# EAGLE design stm32-tf (EAGLE 6.6.0)
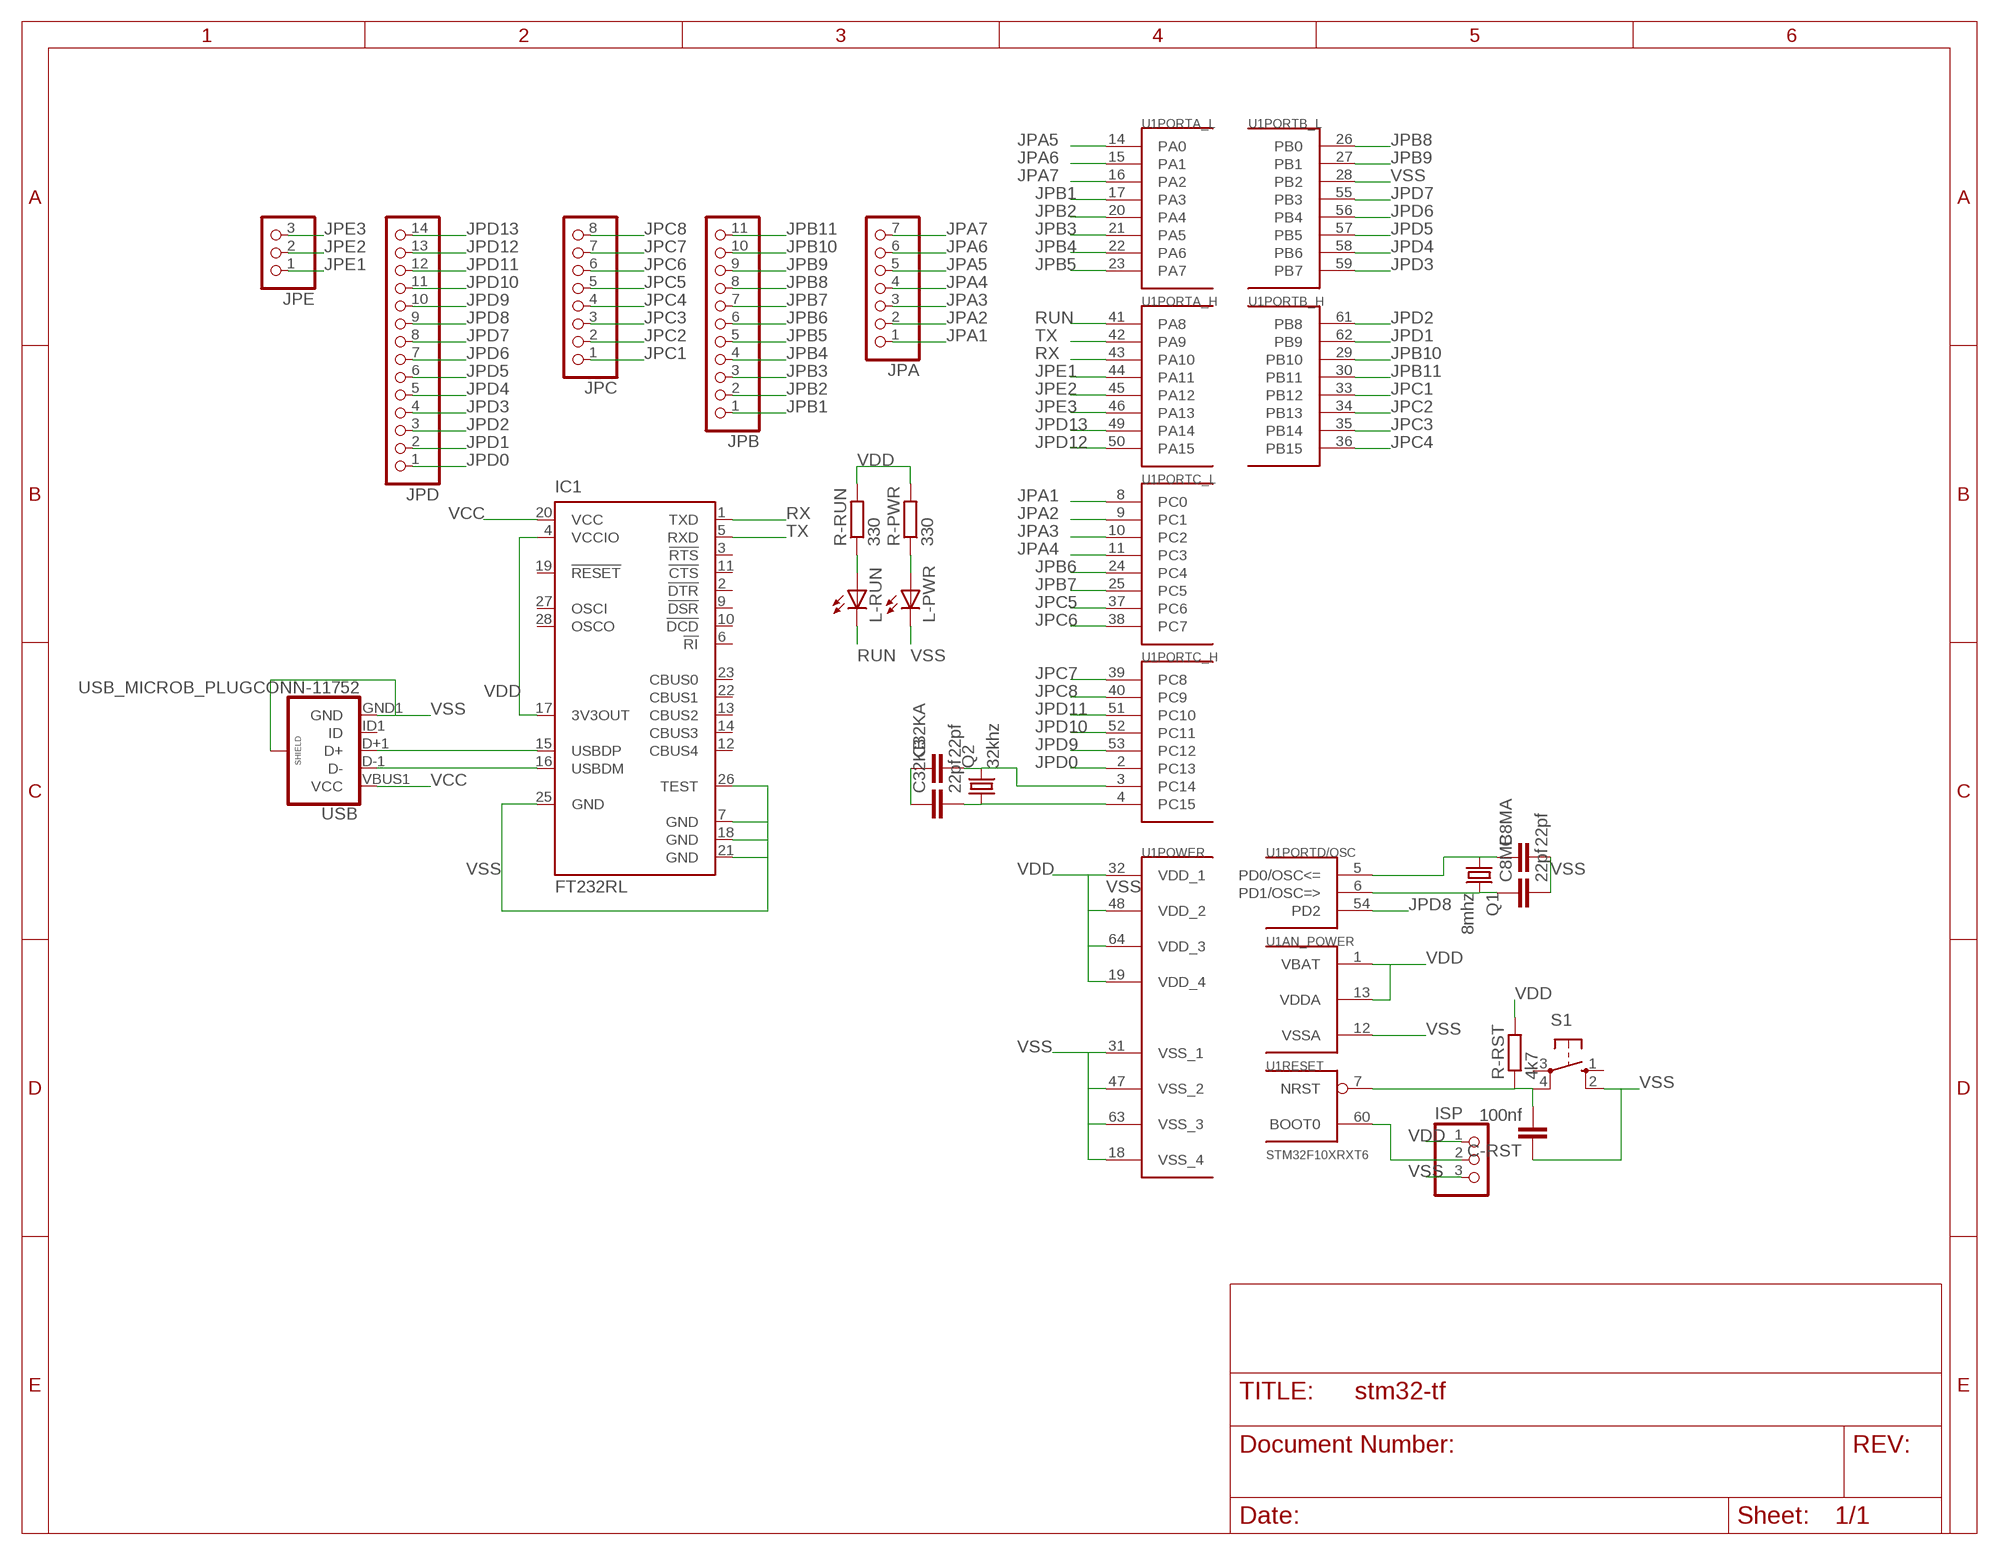
[diagram p0: schematic, sheet 1, part 1 of 2]
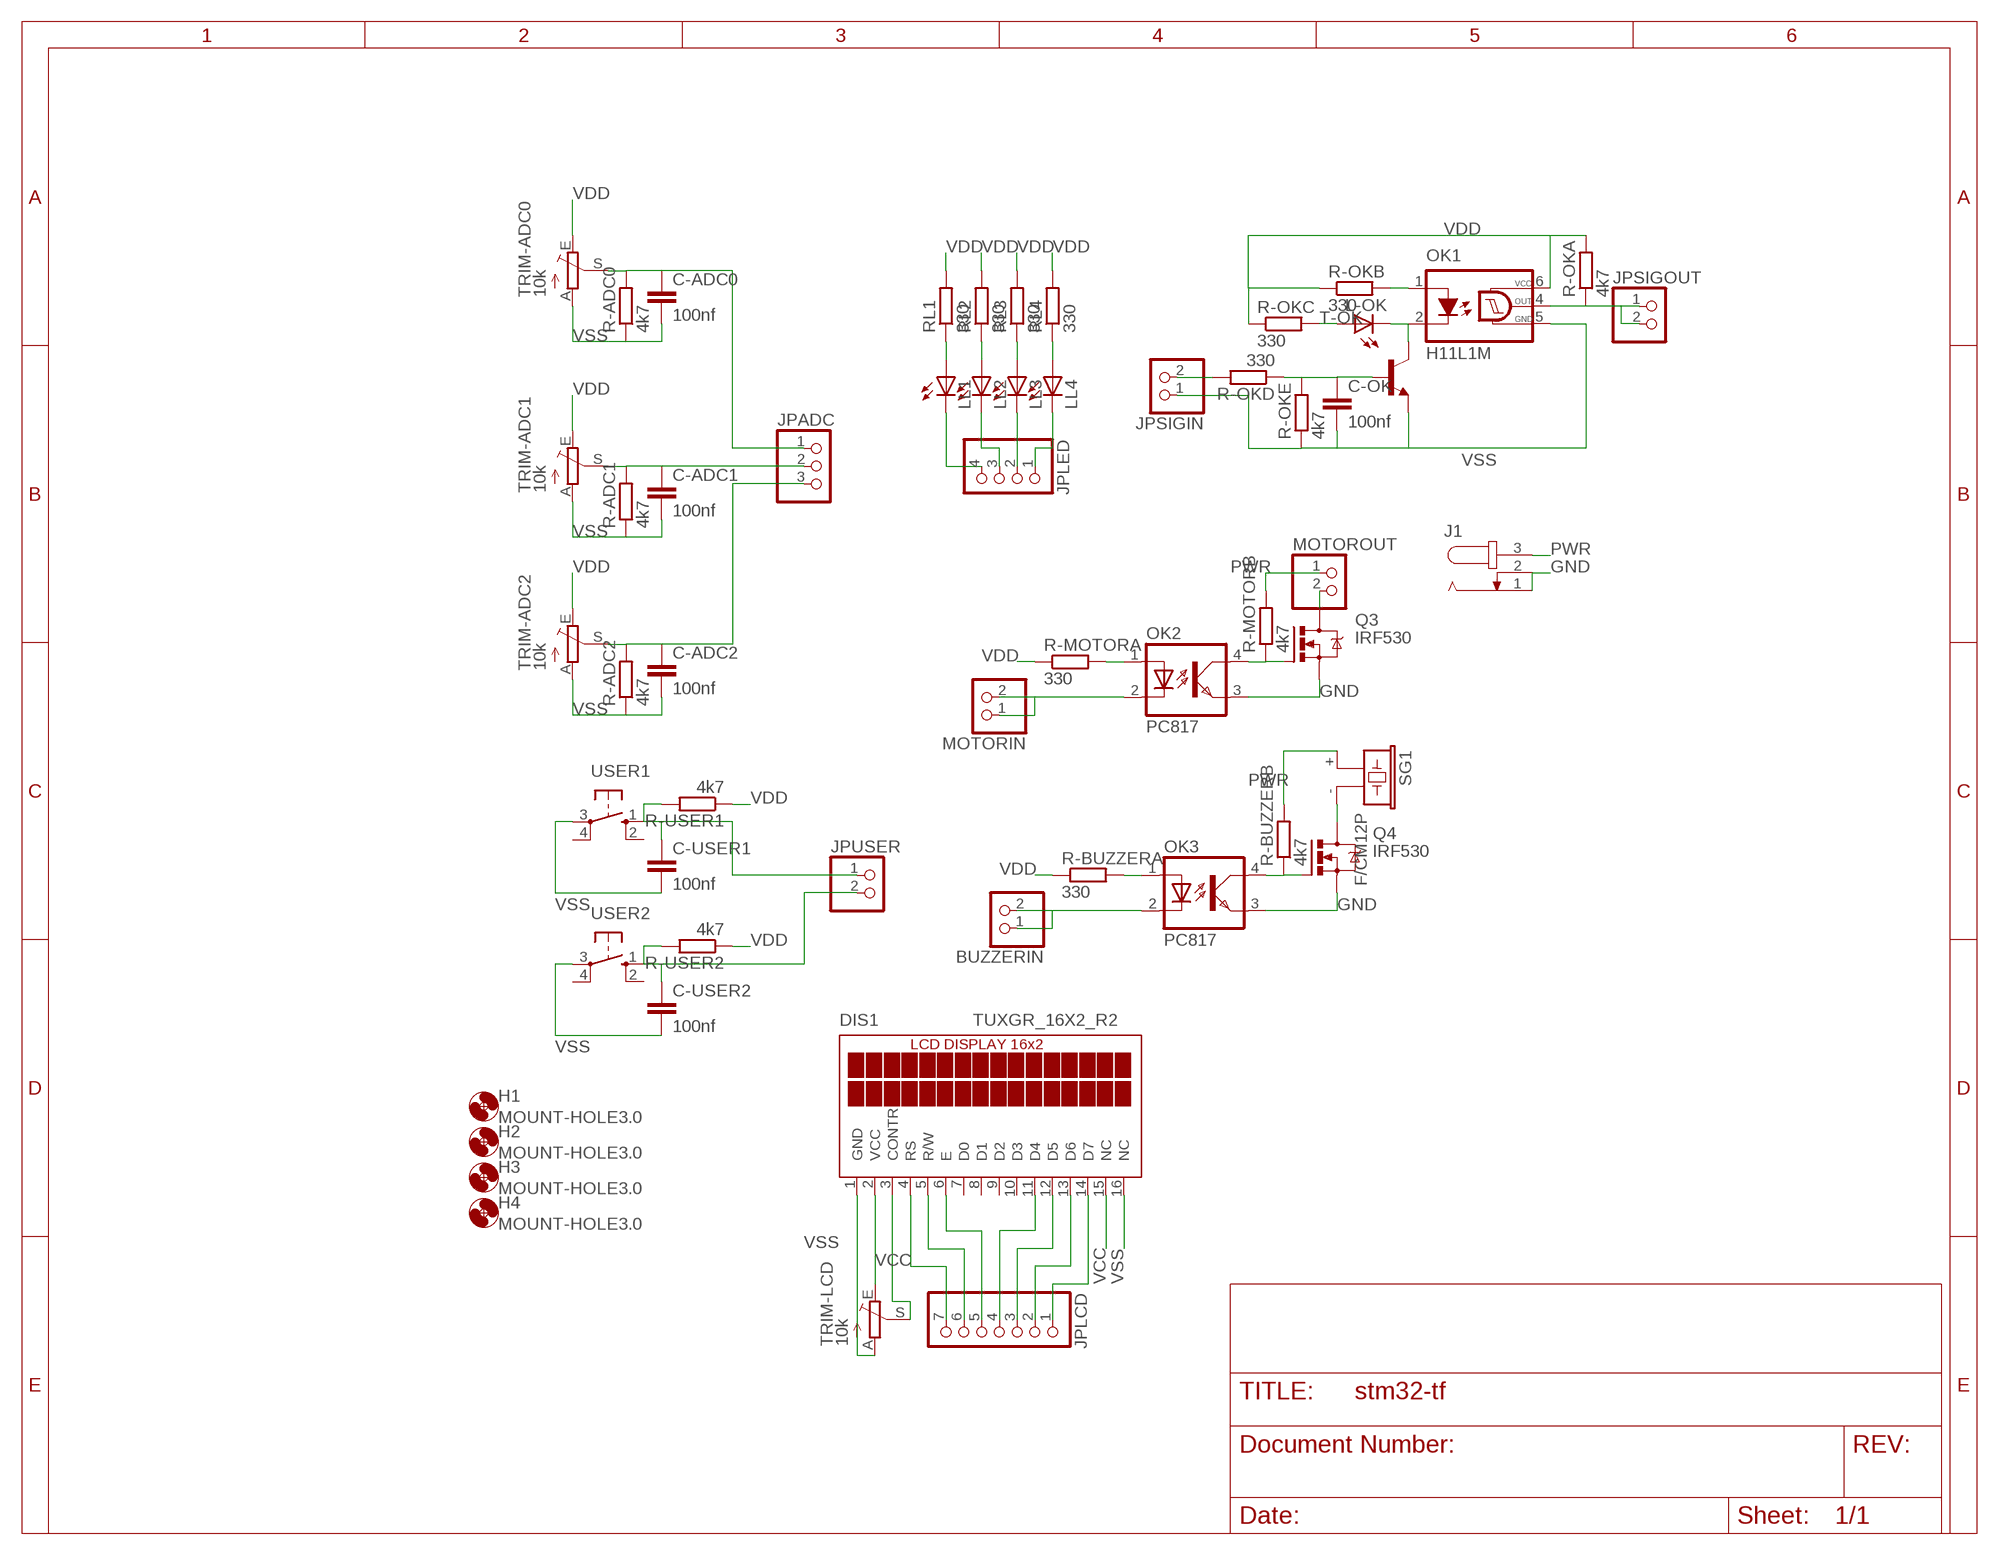
[diagram p1: schematic, sheet 1, part 2 of 2]

## Parts
BUZZERIN  PINHD-1X2  [1X02]
C8MA  22pf  C-EUC1206  [C1206]
C8MB  22pf  C-EUC1206  [C1206]
C32KA  22pf  C-EUC1206  [C1206]
C32KB  22pf  C-EUC1206  [C1206]
C-ADC0  100nf  C-EUC1206  [C1206]
C-ADC1  100nf  C-EUC1206  [C1206]
C-ADC2  100nf  C-EUC1206  [C1206]
C-OK  100nf  C-EUC1206  [C1206]
C-RST  100nf  C-EUC1206  [C1206]
C-USER1  100nf  C-EUC1206  [C1206]
C-USER2  100nf  C-EUC1206  [C1206]
DIS1  TUXGR_16X2_R2  [TUXGR_16X2_R2]
H1  MOUNT-HOLE3.0  [3,0]
H2  MOUNT-HOLE3.0  [3,0]
H3  MOUNT-HOLE3.0  [3,0]
H4  MOUNT-HOLE3.0  [3,0]
IC1  FT232RL  [SSOP28]
ISP  PINHD-1X3  [1X03]
J1  JACK-PLUG0  [SPC4077]
JPA  PINHD-1X7  [1X07]
JPADC  PINHD-1X3  [1X03]
JPB  PINHD-1X11  [1X11]
JPC  PINHD-1X8  [1X08]
JPD  PINHD-1X14  [1X14]
JPE  PINHD-1X3  [1X03]
JPLCD  PINHD-1X7  [1X07]
JPLED  PINHD-1X4  [1X04]
JPSIGIN  PINHD-1X2  [1X02]
JPSIGOUT  PINHD-1X2  [1X02]
JPUSER  PINHD-1X2  [1X02]
L-OK  LEDSML1206  [SML1206]
L-PWR  LEDSML1206  [SML1206]
L-RUN  LEDSML1206  [SML1206]
LL1  LEDSML1206  [SML1206]
LL2  LEDSML1206  [SML1206]
LL3  LEDSML1206  [SML1206]
LL4  LEDSML1206  [SML1206]
MOTORIN  PINHD-1X2  [1X02]
MOTOROUT  PINHD-1X2  [1X02]
OK1  H11L1M  [DIL06]
OK2  PC817  [DIL04]
OK3  PC817  [DIL04]
Q1  8mhz  CRYSTALHC49U-V  [HC49U-V]
Q2  32khz  CRYSTALTC38H  [TC38H]
Q3  IRF530  [TO220BV]
Q4  IRF530  [TO220BV]
R-ADC0  4k7  R-EU_R1206  [R1206]
R-ADC1  4k7  R-EU_R1206  [R1206]
R-ADC2  4k7  R-EU_R1206  [R1206]
R-BUZZERA  330  R-EU_R1206  [R1206]
R-BUZZERB  4k7  R-EU_R1206  [R1206]
R-MOTORA  330  R-EU_R1206  [R1206]
R-MOTORB  4k7  R-EU_R1206  [R1206]
R-OKA  4k7  R-EU_R1206  [R1206]
R-OKB  330  R-EU_R1206  [R1206]
R-OKC  330  R-EU_R1206  [R1206]
R-OKD  330  R-EU_R1206  [R1206]
R-OKE  4k7  R-EU_R1206  [R1206]
R-PWR  330  R-EU_R1206  [R1206]
R-RST  4k7  R-EU_R1206  [R1206]
R-RUN  330  R-EU_R1206  [R1206]
R-USER1  4k7  R-EU_R1206  [R1206]
R-USER2  4k7  R-EU_R1206  [R1206]
RL1  330  R-EU_R1206  [R1206]
RL2  330  R-EU_R1206  [R1206]
RL3  330  R-EU_R1206  [R1206]
RL4  330  R-EU_R1206  [R1206]
S1  10-XX  [B3F-10XX]
SG1  F/CM12P  [F/CM12P]
T-OK  2N3904-NPN-TO92-EBC  [TO92-EBC]
TRIM-ADC0  10k  TRIM_EU-CA6V  [CA6V]
TRIM-ADC1  10k  TRIM_EU-CA6V  [CA6V]
TRIM-ADC2  10k  TRIM_EU-CA6V  [CA6V]
TRIM-LCD  10k  TRIM_EU-CA6V  [CA6V]
U1  STM32F10XRXT6  [TQFP64]
USB  USB_MICROB_PLUGCONN-11752  [USB-B-MICRO-SMD_V03]
USER1  10-XX  [B3F-10XX]
USER2  10-XX  [B3F-10XX]

## Nets
GND: J1.1 J1.2 OK2.3(EMIT) OK3.3(EMIT) Q3.S Q4.S
JPA1: JPA.1 U1.8(PORTC_L:PC0)
JPA2: JPA.2 U1.9(PORTC_L:PC1)
JPA3: JPA.3 U1.10(PORTC_L:PC2)
JPA4: JPA.4 U1.11(PORTC_L:PC3)
JPA5: JPA.5 U1.14(PORTA_L:PA0)
JPA6: JPA.6 U1.15(PORTA_L:PA1)
JPA7: JPA.7 U1.16(PORTA_L:PA2)
JPB1: JPB.1 U1.17(PORTA_L:PA3)
JPB2: JPB.2 U1.20(PORTA_L:PA4)
JPB3: JPB.3 U1.21(PORTA_L:PA5)
JPB4: JPB.4 U1.22(PORTA_L:PA6)
JPB5: JPB.5 U1.23(PORTA_L:PA7)
JPB6: JPB.6 U1.24(PORTC_L:PC4)
JPB7: JPB.7 U1.25(PORTC_L:PC5)
JPB8: JPB.8 U1.26(PORTB_L:PB0)
JPB9: JPB.9 U1.27(PORTB_L:PB1)
JPB10: JPB.10 U1.29(PORTB_H:PB10)
JPB11: JPB.11 U1.30(PORTB_H:PB11)
JPC1: JPC.1 U1.33(PORTB_H:PB12)
JPC2: JPC.2 U1.34(PORTB_H:PB13)
JPC3: JPC.3 U1.35(PORTB_H:PB14)
JPC4: JPC.4 U1.36(PORTB_H:PB15)
JPC5: JPC.5 U1.37(PORTC_L:PC6)
JPC6: JPC.6 U1.38(PORTC_L:PC7)
JPC7: JPC.7 U1.39(PORTC_H:PC8)
JPC8: JPC.8 U1.40(PORTC_H:PC9)
JPD0: JPD.1 U1.2(PORTC_H:PC13)
JPD1: JPD.2 U1.62(PORTB_H:PB9)
JPD2: JPD.3 U1.61(PORTB_H:PB8)
JPD3: JPD.4 U1.59(PORTB_L:PB7)
JPD4: JPD.5 U1.58(PORTB_L:PB6)
JPD5: JPD.6 U1.57(PORTB_L:PB5)
JPD6: JPD.7 U1.56(PORTB_L:PB4)
JPD7: JPD.8 U1.55(PORTB_L:PB3)
JPD8: JPD.9 U1.54(PORTD/OSC:PD2)
JPD9: JPD.10 U1.53(PORTC_H:PC12)
JPD10: JPD.11 U1.52(PORTC_H:PC11)
JPD11: JPD.12 U1.51(PORTC_H:PC10)
JPD12: JPD.13 U1.50(PORTA_H:PA15)
JPD13: JPD.14 U1.49(PORTA_H:PA14)
JPE1: JPE.1 U1.44(PORTA_H:PA11)
JPE2: JPE.2 U1.45(PORTA_H:PA12)
JPE3: JPE.3 U1.46(PORTA_H:PA13)
N$1: C8MB.1 Q1.2 U1.6(PORTD/OSC:PD1/OSC=>)
N$2: C-ADC0.1 JPADC.1 R-ADC0.2 TRIM-ADC0.S
N$3: C32KB.2 Q2.1 U1.4(PORTC_H:PC15)
N$4: C32KA.2 Q2.2 U1.3(PORTC_H:PC14)
N$5: C-RST.2 R-RST.1 S1.4(P1) U1.7(RESET:NRST)
N$6: ISP.2 U1.60(RESET:BOOT0)
N$7: C8MA.1 Q1.1 U1.5(PORTD/OSC:PD0/OSC<=)
N$8: L-RUN.A R-RUN.1
N$9: IC1.16(USBDM) USB.D-1(D-)
N$10: IC1.15(USBDP) USB.D+1(D+)
N$11: C-ADC1.1 JPADC.2 R-ADC1.2 TRIM-ADC1.S
N$12: C-ADC2.1 JPADC.3 R-ADC2.2 TRIM-ADC2.S
N$13: L-PWR.A R-PWR.1
N$14: LL1.A RL1.1
N$15: JPLED.4 LL1.C
N$16: LL2.A RL2.1
N$17: JPLED.3 LL2.C
N$18: LL3.A RL3.1
N$19: JPLED.2 LL3.C
N$20: LL4.A RL4.1
N$21: JPLED.1 LL4.C
N$22: C-USER1.1 JPUSER.1 R-USER1.2 USER1.1(S)
N$23: C-USER2.1 JPUSER.2 R-USER2.2 USER2.1(S)
N$24: C-OK.1 R-OKD.1 R-OKE.2 T-OK.B
N$25: JPSIGIN.2 R-OKD.2
N$26: OK2.1(A) R-MOTORA.2
N$27: L-OK.C OK1.2(C) T-OK.C
N$28: L-OK.A R-OKC.2
N$29: MOTORIN.1 MOTORIN.2 OK2.2(C)
N$30: JPSIGOUT.1 JPSIGOUT.2 OK1.4(OUT) R-OKA.1
N$31: OK1.1(A) R-OKB.2
N$32: OK2.4(COL) Q3.G R-MOTORB.1
N$33: OK3.1(A) R-BUZZERA.2
N$34: MOTOROUT.2 Q3.D
N$35: BUZZERIN.1 BUZZERIN.2 OK3.2(C)
N$36: OK3.4(COL) Q4.G R-BUZZERB.1
N$37: Q4.D SG1.-
N$38: DIS1.4(RS) JPLCD.7
N$39: DIS1.3(CONTR) TRIM-LCD.S
N$40: DIS1.5(R/W) JPLCD.6
N$41: DIS1.6(E) JPLCD.5
N$42: DIS1.11(D4) JPLCD.4
N$43: DIS1.12(D5) JPLCD.3
N$44: DIS1.13(D6) JPLCD.2
N$45: DIS1.14(D7) JPLCD.1
PWR: J1.3 MOTOROUT.1 R-BUZZERB.2 R-MOTORB.2 SG1.+
RUN: L-RUN.C U1.41(PORTA_H:PA8)
RX: IC1.1(TXD) U1.43(PORTA_H:PA10)
TX: IC1.5(RXD) U1.42(PORTA_H:PA9)
VCC: DIS1.2(VCC) DIS1.15(NC) IC1.20(VCC) TRIM-LCD.E USB.VBUS1(VCC)
VDD: IC1.4(VCCIO) IC1.17(3V3OUT) ISP.1 OK1.6(VCC) R-BUZZERA.1 R-MOTORA.1 R-OKA.2 R-OKB.1 R-OKC.1 R-PWR.2 R-RST.2 R-RUN.2 R-USER1.1 R-USER2.1 RL1.2 RL2.2 RL3.2 RL4.2 TRIM-ADC0.E TRIM-ADC1.E TRIM-ADC2.E U1.1(AN_POWER:VBAT) U1.13(AN_POWER:VDDA) U1.19(POWER:VDD_4) U1.32(POWER:VDD_1) U1.48(POWER:VDD_2) U1.64(POWER:VDD_3)
VSS: C8MA.2 C8MB.2 C32KA.1 C32KB.1 C-ADC0.2 C-ADC1.2 C-ADC2.2 C-OK.2 C-RST.1 C-USER1.2 C-USER2.2 DIS1.1(GND) DIS1.16(NC) IC1.7(GND) IC1.18(GND) IC1.21(GND) IC1.25(GND) IC1.26(TEST) ISP.3 JPSIGIN.1 L-PWR.C OK1.5(GND) R-ADC0.1 R-ADC1.1 R-ADC2.1 R-OKE.1 S1.2(S1) T-OK.E TRIM-ADC0.A TRIM-ADC1.A TRIM-ADC2.A TRIM-LCD.A U1.12(AN_POWER:VSSA) U1.18(POWER:VSS_4) U1.28(PORTB_L:PB2) U1.31(POWER:VSS_1) U1.47(POWER:VSS_2) U1.63(POWER:VSS_3) USB.GND1(GND) USB.SHIELD1(SHIELD) USB.SHIELD2(SHIELD) USB.SHIELD3(SHIELD) USER1.3(P) USER2.3(P)
Unconnected: DIS1.7(D0) DIS1.8(D1) DIS1.9(D2) DIS1.10(D3) IC1.2(!DTR) IC1.3(!RTS) IC1.6(!RI) IC1.9(!DSR) IC1.10(!DCD) IC1.11(!CTS) IC1.12(CBUS4) IC1.13(CBUS2) IC1.14(CBUS3) IC1.19(!RESET) IC1.22(CBUS1) IC1.23(CBUS0) IC1.27(OSCI) IC1.28(OSCO) S1.1(S) S1.3(P) USB.ID1(ID) USER1.2(S1) USER1.4(P1) USER2.2(S1) USER2.4(P1)

## Library data of the parts
BUZZERIN JPSIGIN JPSIGOUT JPUSER MOTORIN MOTOROUT = pinhead:PINHD-1X2: PIN HEADER
C8MA C8MB C32KA C32KB C-ADC0 C-ADC1 C-ADC2 C-OK C-RST C-USER1 C-USER2 = resistor:C-EU: CAPACITOR, European symbol
DIS1 = display-lcd:TUXGR_16X2_R2: Tuxgraphics LCD display 16x2 characters reflective, without background light Source: tuxgr_12x2_r2.pdf; OC_FARNELL: unknown; OC_NEWARK: unknown
H1-H4 = holes:MOUNT-HOLE: MOUNTING HOLE with drill center marker
IC1 = ftdichip:FT232R: Source: http://www.ftdichip.com/Documents/DataSheets/DS_FT232R_v104.pdf; MPN: FT232RL; OC_FARNELL: 1146032; OC_NEWARK: 91K9918
ISP JPADC JPE = pinhead:PINHD-1X3: PIN HEADER
J1 = con-jack:JACK-PLUG: DC POWER JACK Power Jack, DC, Right Angle, Through Hole, Rated 5A at 16VDC, PC Terminals Distributor: Farnell (www.Farnell.de) Drawing: 84N1161.pdf / 84N1162.pdf Manufacturer: SPC Technology (www.spctechnology.com) Type: SPC4077 / SPC 4078; OC_FARNELL: unknown; OC_NEWARK: unknown
JPA JPLCD = pinhead:PINHD-1X7: PIN HEADER
JPB = pinhead:PINHD-1X11: PIN HEADER
JPC = pinhead:PINHD-1X8: PIN HEADER
JPD = pinhead:PINHD-1X14: PIN HEADER
JPLED = pinhead:PINHD-1X4: PIN HEADER
L-OK L-PWR L-RUN LL1-LL4 = led:LED: LED OSRAM: - CHIPLED LG R971, LG N971, LY N971, LG Q971, LY Q971, LO R971, LY R971 LH N974, LH R974 LS Q976, LO Q976, LY Q976 LO Q996 - Hyper CHIPLED LW Q18S LB Q993, LB Q99A, LB R99A - SideLED LS A670, LO A670, LY A670, LG A670, LP A670 LB A673, LV A673, LT A673, LW A673 LH A674 LY A675 LS A676, LA A676, LO A676, LY A676, LW A676 LS A679, LY A679, LG A679 - Hyper Micro SIDELED® LS Y876, LA Y876, LO Y876, LY Y876 LT Y87S - SmartLED LW L88C, LW L88S LB L89C, LB L89S, LG L890 LS L89K, LO L89K, LY L89K LS L896, LA L896, LO L896, LY L896 - TOPLED LS T670, LO T670, LY T670, LG T670, LP T670 LSG T670, LSP T670, LSY T670, LOP T670, LYG T670 LG T671, LOG T671, LSG T671 LB T673, LV T673, LT T673, LW T673 LH T674 LS T676, LA T676, LO T676, LY T676, LB T676, LH T676, LSB T676, LW T676 LB T67C, LV T67C, LT T67C, LS T67K, LO T67K, LY T67K, LW E67C LS E67B, LA E67B, LO E67B, LY E67B, LB E67C, LV E67C, LT E67C LW T67C LS T679, LY T679, LG T679 LS T770, LO T770, LY T770, LG T770, LP T770 LB T773, LV T773, LT T773, LW T773 LH T774 LS E675, LA E675, LY E675, LS T675 LS T776, LA T776, LO T776, LY T776, LB T776 LHGB T686 LT T68C, LB T68C - Hyper Mini TOPLED® LB M676 - Mini TOPLED Santana® LG M470 LS M47K, LO M47K, LY M47K Source: http://www.osram.convergy.de LUXEON: - LUMILED® LXK2-PW12-R00, LXK2-PW12-S00, LXK2-PW14-U00, LXK2-PW14-V00 LXK2-PM12-R00, LXK2-PM12-S00, LXK2-PM14-U00 LXK2-PE12-Q00, LXK2-PE12-R00, LXK2-PE12-S00, LXK2-PE14-T00, LXK2-PE14-U00 LXK2-PB12-K00, LXK2-PB12-L00, LXK2-PB12-M00, LXK2-PB14-N00, LXK2-PB14-P00, LXK2-PB14-Q00 LXK2-PR12-L00, LXK2-PR12-M00, LXK2-PR14-Q00, LXK2-PR14-R00 LXK2-PD12-Q00, LXK2-PD12-R00, LXK2-PD12-S00 LXK2-PH12-R00, LXK2-PH12-S00 LXK2-PL12-P00, LXK2-PL12-Q00, LXK2-PL12-R00 Source: www.luxeon.com KINGBRIGHT: KA-3528ASYC Source: www.kingbright.com
OK1 = optocoupler:H11L*M: 6-Pin DIP Optocoupler Source: http://www.fairchildsemi.com/ds/H1/H11L2-M.pdf; MF: FAIRCHILD SEMICONDUCTOR; MPN: H11L1-M; OC_FARNELL: 1021127; OC_NEWARK: 72K8643
OK2 OK3 = optocoupler:PC817: SHARP OPTO COUPLER; MPN: PC817X4J000F; OC_FARNELL: 9707727; OC_NEWARK: 97K7059
Q1 = crystal:CRYSTAL: CRYSTAL; OC_FARNELL: 1666969; OC_NEWARK: unknown
Q2 = crystal:CRYSTAL: CRYSTAL; OC_FARNELL: unknown; OC_NEWARK: unknown
Q3 Q4 = transistor-power:IRF530: HEXFET Power MOSFET
R-ADC0 R-ADC1 R-ADC2 R-BUZZERA R-BUZZERB R-MOTORA R-MOTORB R-OKA R-OKB R-OKC R-OKD R-OKE R-PWR R-RST R-RUN R-USER1 R-USER2 RL1-RL4 = resistor:R-EU_: RESISTOR, European symbol
S1 USER1 USER2 = switch-omron:10-XX: OMRON SWITCH; MPN: B3F-1000; OC_FARNELL: 176432; OC_NEWARK: 36M3542
SG1 = buzzer:F/CM12P: BUZZER Source: Buerklin; OC_FARNELL: unknown; OC_NEWARK: unknown
T-OK = transistor-neu-to92:*-NPN-: NPN Transistror
TRIM-ADC0 TRIM-ADC1 TRIM-ADC2 TRIM-LCD = pot:TRIM_EU-: POTENTIOMETER
U1 = stm32:STM32F10XRXT6: STM32F101/103 64pin LQFP
USB = SparkFun-Connectors:USB_MICROB_PLUG: USB Micro-B connectors Some male, some female. Watch your step!; PROD_ID: CONN-11752

## Board
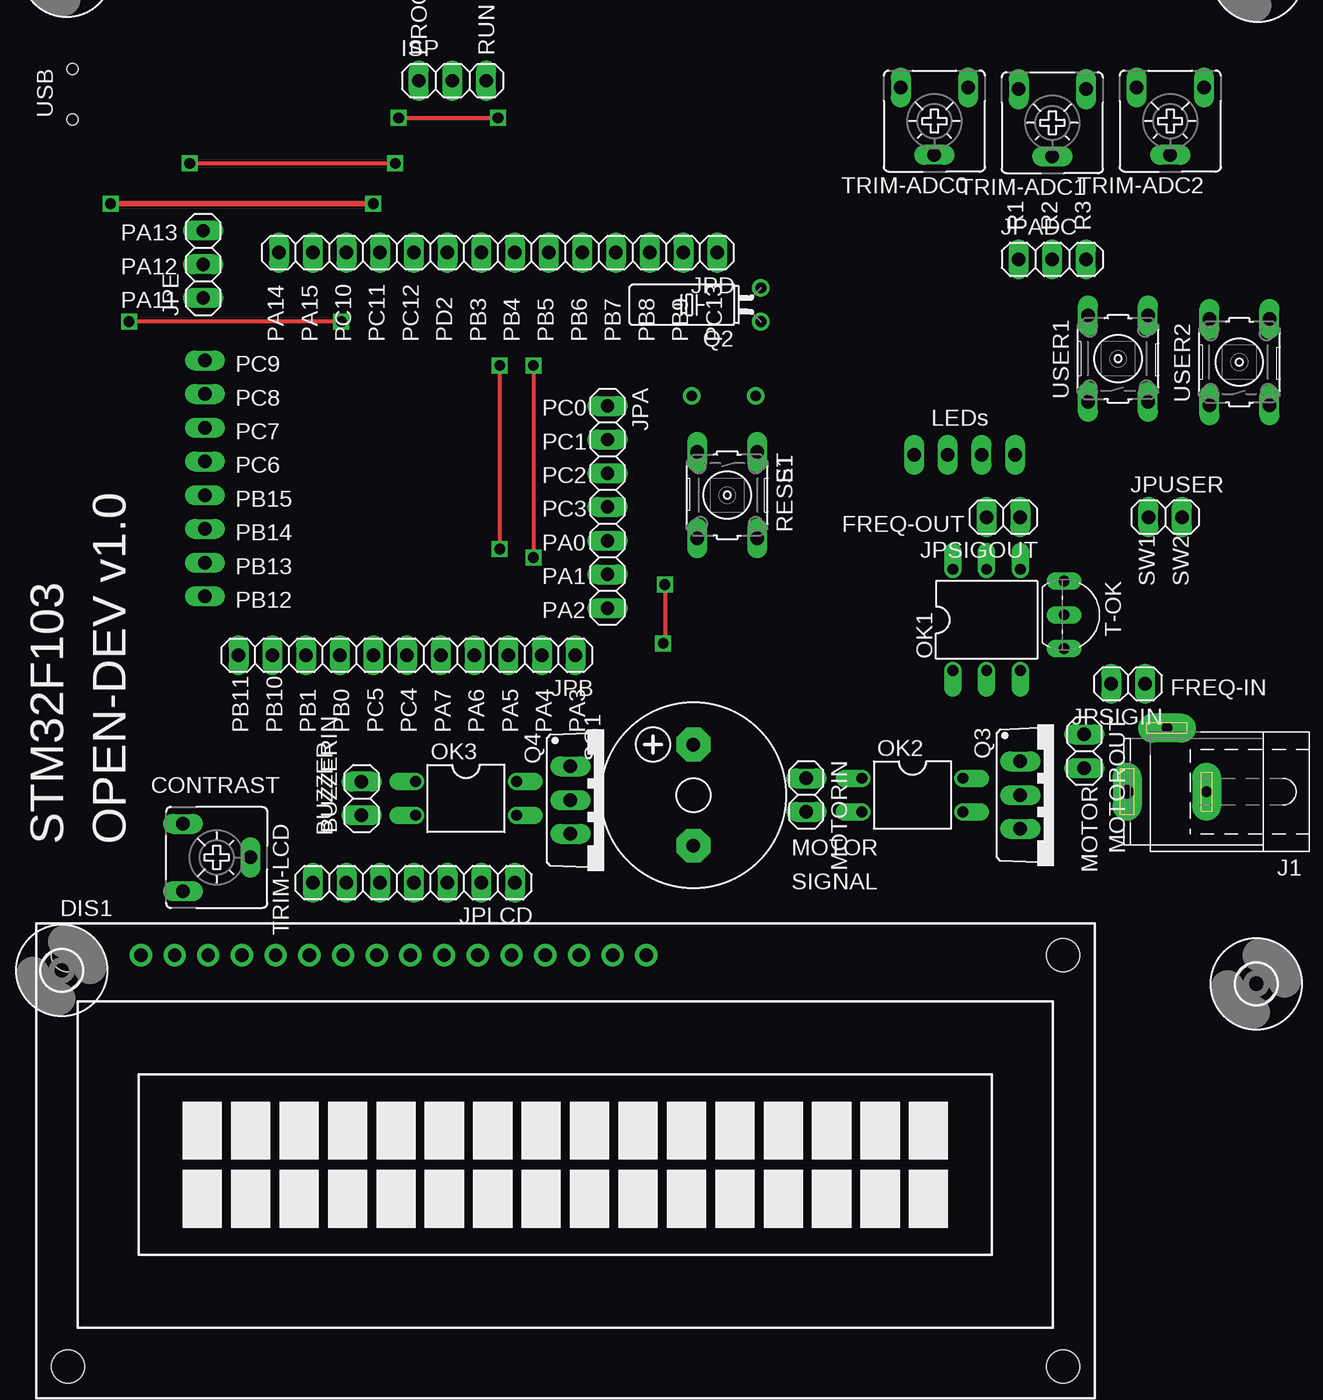
[diagram p2: board, top side]
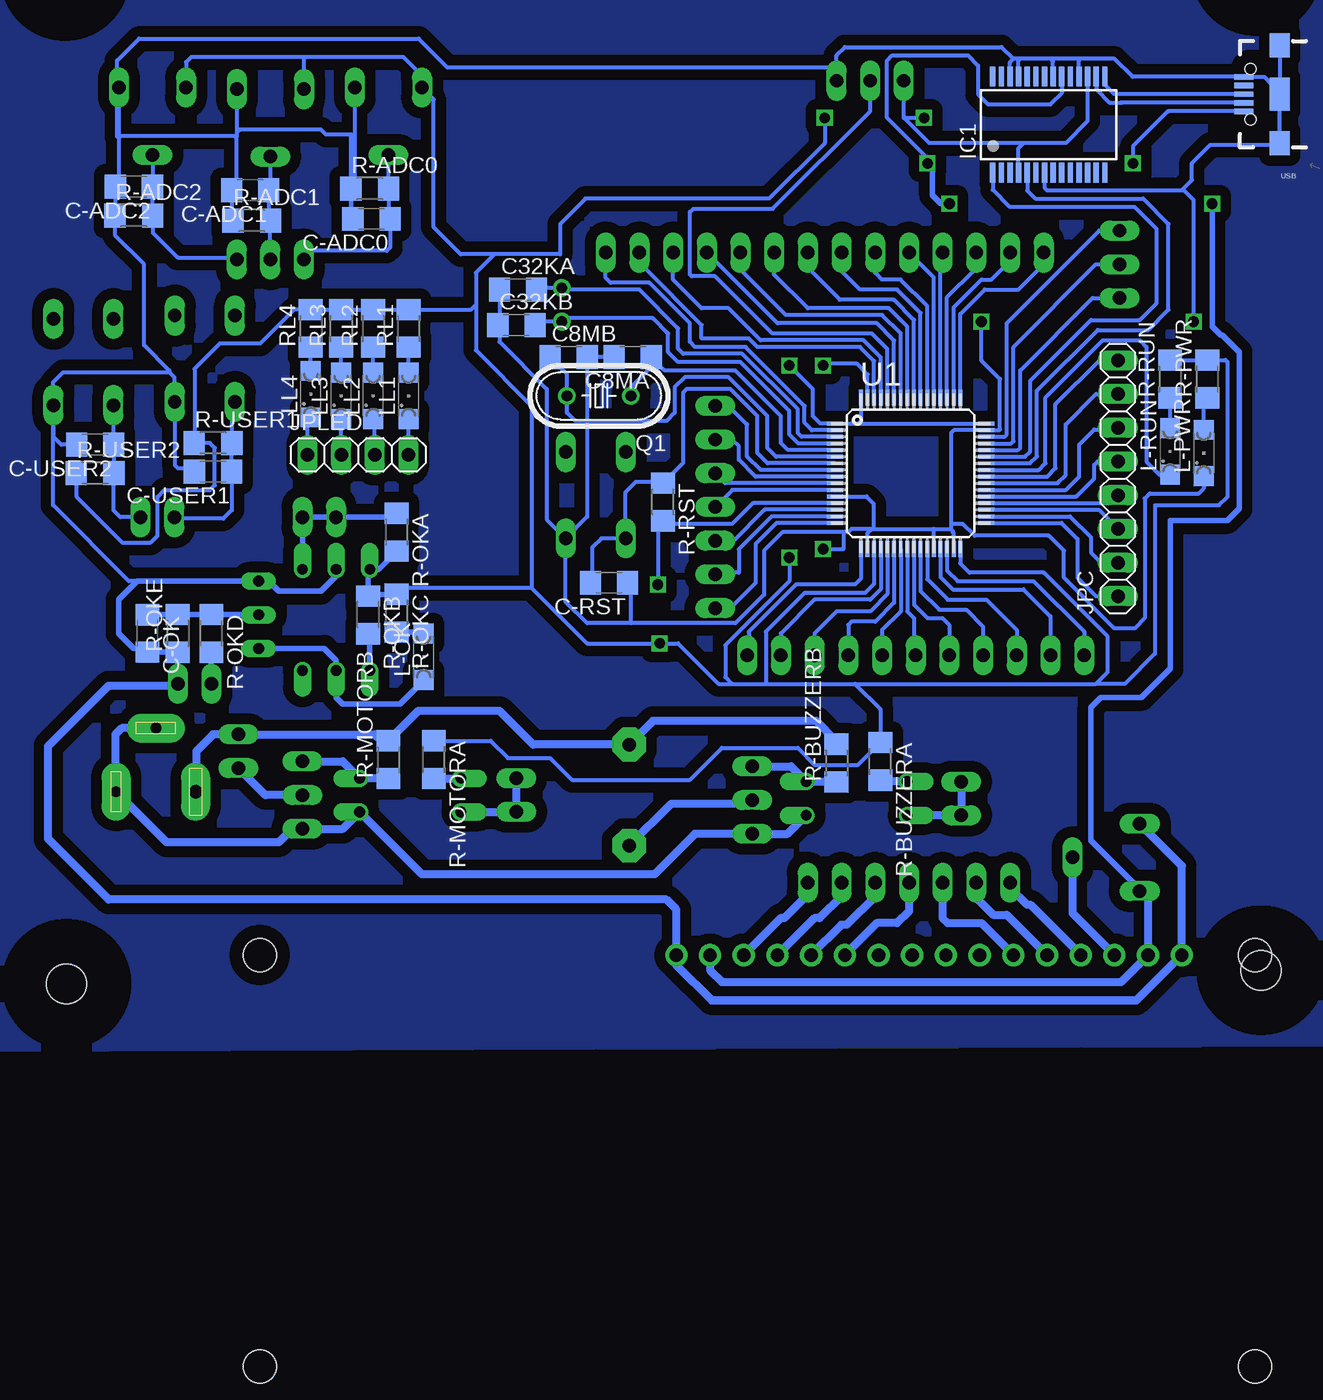
[diagram p3: board, bottom side, seen from below]

No outline drawn. Coordinates in mm, seen from the top.
Copper layers (1*16): Top 0.035mm / dielectric 1.5mm / Bottom 0.035mm
Design rules "default": minimum track width 10mil, minimum drill 24mil, track to track 8mil, track to pad 8mil, pad to pad 8mil, via to via 8mil, smd to smd 8mil, copper to edge 40mil, drill to drill 8mil, minimum pad ring 10mil, minimum via ring 8mil, stop-mask expansion 4mil, vias tented up to drill 0mil, thermal gap 10mil

### Footprints (pad centres in the part's own frame; a part is rotated, then mirrored left to right if it is on the bottom)
1X02 = drill 1.016 long: 1 -1.27,0; 2 1.27,0
C1206 = smd 1.6 x 1.8: 1 -1.4,0; 2 1.4,0
TUXGR_16X2_R2 = drill 1 pad 1.676: 1 -32,15.5; 2 -29.46,15.5; 3 -26.92,15.5; 4 -24.38,15.5; 5 -21.84,15.5; 6 -19.3,15.5; 7 -16.76,15.5; 8 -14.22,15.5; 9 -11.68,15.5; 10 -9.14,15.5; 11 -6.6,15.5; 12 -4.06,15.5; 13 -1.52,15.5; 14 1.02,15.5; 15 3.56,15.5; 16 6.1,15.5 | hole 2.5: -37.5,-15.5; 37.5,-15.5; -37.5,15.5; 37.5,15.5
3,0 = hole 3: 0,0
SSOP28 = smd 0.4 x 1.5: 1 -4.225,-3.625; 2 -3.575,-3.625; 3 -2.925,-3.625; 4 -2.275,-3.625; 5 -1.625,-3.625; 6 -0.975,-3.625; 7 -0.325,-3.625; 8 0.325,-3.625; 9 0.975,-3.625; 10 1.625,-3.625; 11 2.275,-3.625; 12 2.925,-3.625; 13 3.575,-3.625; 14 4.225,-3.625; 15 4.225,3.625; 16 3.575,3.625; 17 2.925,3.625; 18 2.275,3.625; 19 1.625,3.625; 20 0.975,3.625; 21 0.325,3.625; 22 -0.325,3.625; 23 -0.975,3.625; 24 -1.625,3.625; 25 -2.275,3.625; 26 -2.925,3.625; 27 -3.575,3.625; 28 -4.225,3.625
1X03 = drill 1.016 long: 1 -2.54,0; 2 0,0; 3 2.54,0
SPC4077 = drill 0.8 pad 2.184 long: 1 -3,0; 2 0,-4.8 | drill 1 pad 2.184 long: 3 3,0
1X07 = drill 1.016 long: 1 -7.62,0; 2 -5.08,0; 3 -2.54,0; 4 0,0; 5 2.54,0; 6 5.08,0; 7 7.62,0
1X11 = drill 1.016 long: 1 -12.7,0; 2 -10.16,0; 3 -7.62,0; 4 -5.08,0; 5 -2.54,0; 6 0,0; 7 2.54,0; 8 5.08,0; 9 7.62,0; 10 10.16,0; 11 12.7,0
1X08 = drill 1.016 long: 1 -8.89,0; 2 -6.35,0; 3 -3.81,0; 4 -1.27,0; 5 1.27,0; 6 3.81,0; 7 6.35,0; 8 8.89,0
1X14 = drill 1.016 long: 1 -16.51,0; 2 -13.97,0; 3 -11.43,0; 4 -8.89,0; 5 -6.35,0; 6 -3.81,0; 7 -1.27,0; 8 1.27,0; 9 3.81,0; 10 6.35,0; 11 8.89,0; 12 11.43,0; 13 13.97,0; 14 16.51,0
1X04 = drill 1.016 long: 1 -3.81,0; 2 -1.27,0; 3 1.27,0; 4 3.81,0
SML1206 = smd 1.5 x 1.5: A 1.75,0; C -1.75,0
DIL06 = drill 0.813 offset: 1 -2.54,-3.81; 2 0,-3.81; 3 2.54,-3.81; 4 2.54,3.81; 5 0,3.81; 6 -2.54,3.81
DIL04 = drill 0.813 offset: 1 -1.27,-3.81; 2 1.27,-3.81; 3 1.27,3.81; 4 -1.27,3.81
HC49U-V = drill 0.813: 1 -2.413,0; 2 2.413,0
TC38H = drill 0.813: 1 -1.27,0; 2 1.27,0
TO220BV = drill 1.016 long: D 0,-2.54; G -2.54,-2.54; S 2.54,-2.54
R1206 = smd 1.6 x 1.803: 1 -1.422,0; 2 1.422,0
B3F-10XX = drill 1.016 long: 1 -3.251,2.261; 2 3.251,2.261; 3 -3.251,-2.261; 4 3.251,-2.261
F/CM12P = drill 1.016 pad 2.54 octagon: + 3.81,0; - -3.81,0
TO92-EBC = drill 0.813 long: B 0,-1.27; C 2.54,-1.27; E -2.54,-1.27
CA6V = drill 1.016 long: A -2.54,-2.54; E 2.54,-2.54; S 0,2.54
TQFP64 = smd 1.2 x 0.3: 1 -5.7,3.75; 2 -5.7,3.25; 3 -5.7,2.75; 4 -5.7,2.25; 5 -5.7,1.75; 6 -5.7,1.25; 7 -5.7,0.75; 8 -5.7,0.25; 9 -5.7,-0.25; 10 -5.7,-0.75; 11 -5.7,-1.25; 12 -5.7,-1.75; 13 -5.7,-2.25; 14 -5.7,-2.75; 15 -5.7,-3.25; 16 -5.7,-3.75; 33 5.7,-3.75; 34 5.7,-3.25; 35 5.7,-2.75; 36 5.7,-2.25; 37 5.7,-1.75; 38 5.7,-1.25; 39 5.7,-0.75; 40 5.7,-0.25; 41 5.7,0.25; 42 5.7,0.75; 43 5.7,1.25; 44 5.7,1.75; 45 5.7,2.25; 46 5.7,2.75; 47 5.7,3.25; 48 5.7,3.75 | smd 0.3 x 1.2: 17 -3.75,-5.7; 18 -3.25,-5.7; 19 -2.75,-5.7; 20 -2.25,-5.7; 21 -1.75,-5.7; 22 -1.25,-5.7; 23 -0.75,-5.7; 24 -0.25,-5.7; 25 0.25,-5.7; 26 0.75,-5.7; 27 1.25,-5.7; 28 1.75,-5.7; 29 2.25,-5.7; 30 2.75,-5.7; 31 3.25,-5.7; 32 3.75,-5.7; 49 3.75,5.7; 50 3.25,5.7; 51 2.75,5.7; 52 2.25,5.7; 53 1.75,5.7; 54 1.25,5.7; 55 0.75,5.7; 56 0.25,5.7; 57 -0.25,5.7; 58 -0.75,5.7; 59 -1.25,5.7; 60 -1.75,5.7; 61 -2.25,5.7; 62 -2.75,5.7; 63 -3.25,5.7; 64 -3.75,5.7
USB-B-MICRO-SMD_V03 = smd 1.4 x 0.4: D+1 2.7,0; D-1 2.7,0.65; GND1 2.7,-1.3; ID1 2.7,-0.65; VBUS1 2.7,1.3 | smd 1.5 x 1.8: SHIELD1 0,3.7; SHIELD2 0,-3.7 | smd 1.5 x 2.5: SHIELD3 0,0 | hole 0.85: 2.2,1.9; 2.2,-1.9

### Placement (x,y rotation side)
BUZZERIN  26.92,17.65 90 top
C8MA  51.69,50.93 180 bottom
C8MB  56.52,50.93 0 bottom
C32KA  60.33,56.01 0 bottom
C32KB  60.45,53.34 0 bottom
C-ADC0  71.37,61.34 180 bottom
C-ADC1  80.52,63.5 180 bottom
C-ADC2  89.28,63.75 180 bottom
C-OK  88.27,30.1 270 bottom
C-RST  53.47,33.91 180 bottom
C-USER1  83.31,42.29 180 bottom
C-USER2  92.2,44.32 180 bottom
DIS1  42.29,-9.65 0 top
H1  94.36,3.68 0 top
H2  94.49,79.63 0 top
H3  4.7,80.01 0 top
H4  4.32,4.7 0 top
IC1  20.32,68.45 0 bottom
ISP  33.78,71.75 0 top
J1  87.63,18.16 180 top
JPA  45.47,39.62 270 top
JPADC  78.99,58.29 0 top
JPB  30.35,28.45 180 top
JPC  15.11,41.78 90 bottom
JPD  37.21,58.8 180 top
JPE  14.99,57.91 90 top
JPLCD  30.86,11.3 180 top
JPLED  72.39,43.56 0 bottom
JPSIGIN  84.71,26.29 180 top
JPSIGOUT  75.31,38.86 180 top
JPUSER  87.5,38.86 0 top
L-OK  67.44,28.32 90 bottom
L-PWR  8.64,43.69 90 bottom
L-RUN  11.18,43.81 90 bottom
LL1  68.58,48.01 90 bottom
LL2  71.25,48.01 90 bottom
LL3  73.66,48.01 90 bottom
LL4  75.95,48.13 90 bottom
MOTORIN  60.45,17.91 270 top
MOTOROUT  81.41,21.21 270 top
OK1  74.04,31.11 0 top
OK2  68.45,17.91 270 top
OK3  34.8,17.65 270 top
Q1  54.23,48.01 180 bottom
Q2  57.02,54.86 90 top
Q3  79.12,17.91 270 top
Q4  45.21,17.53 270 top
R-ADC0  71.5,63.63 0 bottom
R-ADC1  80.39,61.21 0 bottom
R-ADC2  89.28,61.59 0 bottom
R-BUZZERA  33.02,20.45 270 bottom
R-BUZZERB  36.32,20.32 90 bottom
R-MOTORA  66.67,20.57 270 bottom
R-MOTORB  70.1,20.57 90 bottom
R-OKA  69.47,37.72 270 bottom
R-OKB  71.63,31.5 270 bottom
R-OKC  69.47,31.62 270 bottom
R-OKD  83.44,30.1 270 bottom
R-OKE  85.98,30.1 90 bottom
R-PWR  8.38,49.28 90 bottom
R-RST  49.4,40.01 270 bottom
R-RUN  11.18,49.28 90 bottom
R-USER1  83.31,44.45 0 bottom
R-USER2  92.2,42.16 0 bottom
RL1  68.58,53.09 90 bottom
RL2  71.25,53.09 90 bottom
RL3  73.66,53.09 90 bottom
RL4  75.95,53.09 90 bottom
S1  54.48,40.51 270 top
SG1  51.94,17.91 90 top
T-OK  81.15,31.5 270 top
TRIM-ADC0  70.1,68.71 180 top
TRIM-ADC1  78.99,68.58 180 top
TRIM-ADC2  87.88,68.71 180 top
TRIM-LCD  16,13.21 270 top
U1  30.73,42.16 0 bottom
USB  2.92,70.74 180 bottom
USER1  83.95,50.8 90 top
USER2  93.09,50.55 90 top

### Tracks (layer width: path | path; a pad name or v marks a point on that pad's centre or on a via)
GND
  Bottom 0.61: OK3.3 40.01,14.99 Q4.S 46.99,14.99 50.04,11.94 67.56,11.94 OK2.3 73.53,15.37 Q3.S 77.34,15.37 78.36,14.35 86.82,14.35 J1.1 90.68,18.21 90.68,22.48 90.2,22.96 J1.2
JPA1
  Bottom 0.305: U1.8 42.03,42.41 43.05,43.43 43.05,45.85 44.45,47.24 JPA.1
JPA2
  Bottom 0.305: U1.9 42.42,41.91 43.69,43.18 43.69,44.2 44.07,44.58 45.34,44.58 JPA.2
JPA3
  Bottom 0.305: U1.10 44.72,41.41 JPA.3
JPA4
  Bottom 0.305: U1.11 44.18,40.91 JPA.4
JPA5
  Bottom 0.305: U1.14 41.74,39.41 44.2,36.96 45.34,36.96 JPA.5
JPA6
  Bottom 0.305: U1.15 41.22,38.91 43.69,36.45 43.69,34.67 45.34,34.67 JPA.6
JPA7
  Bottom 0.305: U1.16 40.83,38.41 42.42,36.83 42.42,33.91 44.32,32 JPA.7
JPB1
  Bottom 0.305: JPB.1 42.93,28.57 42.93,30.23 39.37,33.78 34.92,33.78 34.48,34.22 U1.17
JPB2
  Bottom 0.305: U1.20 32.98,33.44 33.78,32.64 37.97,32.64 40.51,30.1 JPB.2
JPB3
  Bottom 0.305: U1.21 32.48,33.05 33.78,31.75 36.32,31.75 37.97,30.1 JPB.3
JPB4
  Bottom 0.305: U1.22 31.98,32.41 33.4,30.99 35.18,30.99 35.43,30.73 JPB.4
JPB5
  Bottom 0.305: U1.23 31.48,31.76 32.89,30.35 JPB.5
JPB6
  Bottom 0.305: U1.24 30.98,31.75 30.48,31.24 30.48,28.57 JPB.6
JPB7
  Bottom 0.305: U1.25 30.48,32.26 29.46,31.24 28.32,31.24 27.81,30.73 JPB.7
JPB8
  Bottom 0.305: U1.26 29.98,33.29 28.57,31.88 26.54,31.88 25.27,30.61 JPB.8
JPB9
  Bottom 0.305: U1.27 29.48,34.18 27.94,32.64 25.02,32.64 22.73,30.35 JPB.9
JPB10
  Bottom 0.305: U1.29 28.48,34.33 27.56,33.4 22.23,33.4 20.19,31.37 JPB.10
JPB11
  Bottom 0.305: U1.30 27.98,34.84 27.18,34.04 21.46,34.04 17.65,30.23 JPB.11
JPC1
  Bottom 0.305: U1.33 19.36,38.41 18.16,37.21 18.16,34.29 16.76,32.89 JPC.1
JPC2
  Bottom 0.305: U1.34 18.72,38.91 17.14,37.34 17.14,36.2 16.38,35.43 JPC.2
JPC3
  Bottom 0.305: U1.35 16.55,39.41 JPC.3
JPC4
  Bottom 0.305: U1.36 15.71,39.91 JPC.4
JPC5
  Bottom 0.305: U1.37 18.26,40.41 16.89,41.78 16.89,42.8 16.64,43.05 JPC.5
JPC6
  Bottom 0.305: U1.38 19.03,40.91 18.03,41.91 18.03,44.32 16.89,45.47 15.24,45.47 JPC.6
JPC7
  Bottom 0.305: U1.39 19.67,41.41 19.05,42.04 19.05,45.85 16.76,48.13 JPC.7
JPC8
  Bottom 0.305: U1.40 20.44,41.91 19.81,42.55 19.81,47.37 16.51,50.67 JPC.8
JPD0
  Bottom 0.305: U1.2 38.17,45.41 38.73,45.97 38.73,47.24 43.18,51.69 46.99,51.69 47.37,52.07 47.37,53.47 50.42,56.52 53.34,56.52 53.72,56.9 JPD.1
JPD1
  Bottom 0.305: U1.62 33.48,50.63 34.54,51.69 42.29,51.69 42.93,52.32 46.48,52.32 46.48,53.34 50.8,57.66 50.8,58.42 JPD.2
JPD2
  Bottom 0.305: U1.61 32.98,50.89 34.29,52.2 42.04,52.2 44.45,54.61 46.48,54.61 48.64,56.77 JPD.3
JPD3
  Bottom 0.305: U1.59 31.98,52.18 33.27,53.47 40.77,53.47 JPD.4
JPD4
  Bottom 0.305: U1.58 31.48,52.69 32.89,54.1 40.13,54.1 43.56,57.53 JPD.5
JPD5
  Bottom 0.305: U1.57 30.98,53.21 32.38,54.61 38.48,54.61 41.02,57.15 JPD.6
JPD6
  Bottom 0.305: U1.56 30.48,53.73 32,55.24 36.07,55.24 38.48,57.66 JPD.7
JPD7
  Bottom 0.305: U1.55 29.98,54.24 31.75,56.01 34.54,56.01 36.07,57.53 36.07,58.67 JPD.8
JPD8
  Bottom 0.305: U1.54 29.48,54.76 31.5,56.77 32.89,56.77 33.4,57.28 JPD.9
JPD9
  Bottom 0.305: U1.53 28.98,56.92 JPD.10
JPD10
  Bottom 0.305: U1.52 28.48,58.64 JPD.11
JPD11
  Bottom 0.305: U1.51 27.98,55.45 25.91,57.53 25.91,58.67 JPD.12
JPD12
  Bottom 0.305: U1.50 27.48,54.69 25.4,56.77 24.64,56.77 23.24,58.17 JPD.13
JPD13
  Bottom 0.305: U1.49 26.98,54.17 25.15,56.01 22.61,56.01 20.7,57.91 JPD.14
JPE1
  Bottom 0.305: U1.44 22.63,43.91 22.48,44.07 22.48,49.91 17.02,55.37 JPE.1
JPE2
  Bottom 0.305: U1.45 23.15,44.41 22.99,44.58 22.99,51.69 16.76,57.91 JPE.2
JPE3
  Bottom 0.305: U1.46 23.67,44.91 23.5,45.09 23.5,53.47 16.51,60.45 JPE.3
N$1
  Bottom 0.305: U1.6 40.87,43.41 41.53,44.07 41.53,46.48 44.45,49.4 47.75,49.4 48.51,48.64 48.51,46.74 49.15,46.1 56.01,46.1 56.64,46.74 Q1.2 56.64,49.65 C8MB.1
N$2
  Bottom 0.305: TRIM-ADC0.S 70.1,63.65 R-ADC0.2 70.08,61.45 C-ADC0.1 69.97,59.19 70.23,58.93 75.82,58.93 JPADC.1
N$3
  Bottom 0.305: C32KB.2 58.8,53.59 Q2.1 56.77,53.85 50.16,53.85 49.02,52.7 49.02,51.31 48.26,50.55 43.56,50.55 39.88,46.86 39.88,45.09 39.21,44.41 U1.4
N$4
  Bottom 0.305: C32KA.2 58.8,56.13 Q2.2 56.9,56.01 51.18,56.01 48.26,53.09 48.26,51.56 47.88,51.18 43.43,51.18 39.24,46.99 39.24,45.21 38.95,44.91 U1.3
N$5
  Bottom 0.305: U1.7 41.52,42.91 42.29,43.69 42.29,46.48 44.32,48.51 47.62,48.51 47.88,48.26 47.88,42.95 R-RST.1 49.51,41.53 51.44,41.53 52.22,40.74 S1.4 54.05,37.26 54.74,36.58 54.74,33.78 | 54.74,33.4 54.74,33.78 | 54.74,33.78 C-RST.2
N$6
  Bottom 0.305: U1.60 32.48,51.53 33.66,52.7 41.15,52.7 45.47,57.02 47.24,57.02 47.37,57.15 47.37,61.85 47.12,62.1 41.15,62.1 33.78,69.47 ISP.2
N$7
  Bottom 0.305: U1.5 39.98,43.91 40.51,44.45 40.51,46.48 43.94,49.91 49.27,49.91 49.91,50.55 | 49.91,50.55 C8MA.1 | Q1.1 51.82,48.64 49.91,50.55
N$8
  Bottom 0.305: L-RUN.A R-RUN.1
N$9
  Bottom 0.305: USB.D-1 14.84,70.09 14.86,70.1 15.75,70.1 16.75,71.1 IC1.16
N$10
  Bottom 0.305: USB.D+1 15.37,70.74 16.09,71.47 IC1.15
N$11
  Bottom 0.305: TRIM-ADC1.S 78.99,63.38 | 79.12,62.99 78.99,63.12 78.99,63.38 | 78.99,63.38 C-ADC1.1 79.12,61.36 R-ADC1.2 78.99,61.19 JPADC.2
N$12
  Bottom 0.305: TRIM-ADC2.S C-ADC2.1 87.86,63.73 R-ADC2.2 87.86,60.3 85.98,58.42 81.66,58.42 JPADC.3
N$13
  Bottom 0.305: L-PWR.A 8.64,47.6 R-PWR.1
N$14
  Bottom 0.305: LL1.A RL1.1
N$15
  Bottom 0.305: JPLED.4 LL1.C
N$16
  Bottom 0.305: LL2.A 71.25,51.05 71.37,51.18 71.37,51.54 RL2.1
N$17
  Bottom 0.305: JPLED.3 71.12,46.13 LL2.C
N$18
  Bottom 0.305: LL3.A RL3.1
N$19
  Bottom 0.305: JPLED.2 LL3.C
N$20
  Bottom 0.305: LL4.A RL4.1
N$21
  Bottom 0.305: JPLED.1 76.2,46.13 LL4.C
N$22
  Bottom 0.305: USER1.1 81.89,47.34 R-USER1.2 81.91,44.43 C-USER1.1 81.91,39.37 82.55,38.73 86.11,38.73 JPUSER.1
N$23
  Bottom 0.305: JPUSER.2 90.3,38.86 90.81,39.37 90.81,42.14 R-USER2.2 90.8,42.19 C-USER2.1 90.83,44.35 USER2.1
N$24
  Bottom 0.406: C-OK.1 88.24,31.52 R-OKE.2 R-OKD.1 79.91,31.52 T-OK.B
N$25
  Bottom 0.406: JPSIGIN.2 R-OKD.2 | R-OKD.2 83.44,29.08 83.57,29.21 83.57,28.8 R-OKD.2
N$26
  Bottom 0.61: R-MOTORA.2 64.67,19.15 OK2.1
N$27
  Bottom 0.406: L-OK.C 67.44,26.54 69.22,24.77 73.53,24.77 74.04,25.27 OK1.2 74.04,28.07 74.93,28.96 T-OK.C
N$28
  Bottom 0.406: R-OKC.2 67.57,30.2 L-OK.A
N$29
  Bottom 0.61: OK2.2 MOTORIN.2 MOTORIN.1
N$30
  Bottom 0.406: OK1.4 JPSIGOUT.1 JPSIGOUT.2 69.75,38.86 R-OKA.1
N$31
  Bottom 0.406: OK1.1 71.5,29.95 R-OKB.2
N$32
  Bottom 0.61: R-MOTORB.1 72.24,19.15 OK2.4 73.53,20.45 Q3.G
N$33
  Bottom 0.61: OK3.1 33.12,18.92 | 33.53,18.92 33.12,18.92 | 33.12,18.92 R-BUZZERA.2
N$34
  Bottom 0.61: Q3.D 79.38,17.91 MOTOROUT.2
N$35
  Bottom 0.61: BUZZERIN.2 BUZZERIN.1 OK3.2
N$36
  Bottom 0.61: Q4.G 39.75,20.07 OK3.4 36.35,18.92 R-BUZZERB.1
N$37
  Bottom 0.61: SG1.- 48.77,17.27 42.93,17.27 Q4.D
N$38
  Bottom 0.61: JPLCD.7 23.24,10.92 21.97,9.65 21.71,9.65 DIS1.4
N$39
  Bottom 0.61: TRIM-LCD.S 18.54,9.02 DIS1.3
N$40
  Bottom 0.61: JPLCD.6 25.78,10.16 24.51,8.89 23.49,8.89 DIS1.5
N$41
  Bottom 0.61: JPLCD.5 28.32,8.64 27.94,8.26 25.4,8.26 DIS1.6
N$42
  Bottom 0.61: JPLCD.4 30.86,9.14 31.75,8.26 33.28,8.26 DIS1.11
N$43
  Bottom 0.61: JPLCD.3 33.4,10.29 35.56,8.13 35.95,8.13 DIS1.12
N$44
  Bottom 0.61: JPLCD.2 35.94,10.29 37.59,8.64 37.98,8.64 DIS1.13
N$45
  Bottom 0.61: JPLCD.1 38.48,10.41 40.26,8.64 40.52,8.64 DIS1.14
N$46
  pour Bottom (isolate 0.813): -0.38,86.11 100.33,85.98 100.33,-1.02 -0.38,-0.64
PWR
  Bottom 0.61: R-BUZZERB.2 36.35,21.72 36.35,22 37.85,23.5 50.16,23.5 SG1.+ 59.18,21.72 61.72,24.26 67.84,24.26 R-MOTORB.2 70.13,21.97 70.61,21.97 71.12,22.48 MOTOROUT.1 83.31,22.48 84.58,21.21 84.58,18.21 J1.3
RUN
  Bottom 0.305: U1.41 21.09,42.41 20.57,42.93 20.57,47.88 16.26,52.2 13.46,52.2 12.95,51.69 12.95,43.05 11.94,42.04 11.2,42.04 L-RUN.C
RX
  Bottom 0.305: U1.43 22.12,43.41 21.72,43.81 21.72,49.15 17.14,53.72 13.46,53.72 12.19,54.99 12.19,60.58 13.84,62.23 23.24,62.23 24.55,63.53 IC1.1
TX
  Bottom 0.305: U1.42 21.73,42.91 21.21,43.43 21.21,48.39 16.64,52.96 12.83,52.96 11.3,54.48 11.3,60.96 13.21,62.87 21.34,62.87 21.95,63.47 IC1.5
VCC  (via drill 0.8)
  Top 0.305: v13.97,65.53 v29.46,65.53
  Top 0.406: v8,62.48 v27.81,62.48
  Bottom 0.305: v13.97,65.53 13.97,66.8 11.33,69.44 USB.VBUS1 | v29.46,65.53 29.46,65.91 32.51,68.96 32.51,73.28 32.13,73.66 26.42,73.66 25.65,72.9 25.65,70.74 24.89,69.98 20.19,69.98 19.34,70.83 IC1.20
  Bottom 0.406: TRIM-LCD.E 13.46,10.79 17.14,14.48 17.14,24.51 16.38,25.27 13.34,25.27 11.18,27.43 11.18,38.61 6.86,38.61 5.97,39.5 5.97,51.31 7.24,52.58 7.37,52.58 8,53.21 v8,62.48 | v27.81,62.48 28.45,62.48 29.08,63.12 29.08,65.15 v29.46,65.53
  Bottom 0.61: DIS1.15 45.85,4.7 44.96,3.81 14.87,3.81 DIS1.2 12.83,10.04 TRIM-LCD.E
VDD  (via drill 0.8)
  Top 0.305: v39.88,50.29 v39.88,35.81 | v49.78,33.78 49.78,29.46 v49.66,29.34 | v29.72,68.96 v37.21,68.96
  Bottom 0.305: R-PWR.2 R-RUN.2 7.01,50.7 6.86,50.55 6.86,40.39 7.49,39.75 12.32,39.75 12.32,28.57 14.61,26.29 16.64,26.29 16.7,26.35 | 49.17,38.35 44.2,38.35 42.64,39.91 U1.13 | 49.17,38.35 R-RST.2 | U1.19 33.48,33.83 34.16,33.15 38.73,33.15 41.66,30.23 41.66,26.29 | 34.92,26.29 16.76,26.29 16.7,26.35 | 16.7,26.35 15.88,27.18 15.88,29.84 20.7,34.67 26.29,34.67 26.98,35.37 U1.32 | 34.67,45.91 U1.1 37.53,45.91 38.1,46.48 38.1,48.51 v39.88,50.29 | 34.67,45.91 U1.48 | U1.64 34.48,46.1 34.67,45.91 | IC1.17 17.39,68.71 19.05,67.06 22.23,67.06 | IC1.4 22.59,66.69 22.23,67.06 | 31.24,68.96 ISP.1 | v39.88,35.81 39.88,34.04 44.7,29.21 44.7,26.8 44.2,26.29 | 44.2,26.29 41.66,26.29 | 49.17,38.35 49.4,38.35 49.78,37.97 v49.78,33.78 | 44.2,26.29 45.21,26.29 48.26,29.34 v49.66,29.34 55.12,29.34 59.31,33.53 | 22.23,67.06 29.34,67.06 31.24,68.96 | 31.24,68.96 v29.72,68.96 | v37.21,68.96 37.21,67.06 41.4,62.87 55.24,62.87 57.15,60.96 57.15,58.67 62.1,58.67 | 62.1,58.67 63.5,57.28 63.5,54.86 | 63.5,54.86 63.5,51.44 59.31,47.24 59.31,33.53 | R-USER2.1 93.62,40.41 90.17,36.96 88.01,36.96 87.5,37.47 87.5,40.39 87,40.89 83.57,40.89 83.19,41.27 83.19,44.07 83.57,44.45 R-USER1.1 84.71,44.48 84.71,50.04 82.8,51.94 79.76,51.94 77.19,54.51 RL4.2 RL3.2 RL2.2 RL1.2 63.86,54.51 63.5,54.86 | 41.66,26.29 34.92,26.29 | 34.92,26.29 33.02,24.38 R-BUZZERA.1 34.7,20.19 37.97,20.19 39.24,21.46 44.96,21.46 47.37,19.05 56.26,19.05 57.91,20.7 61.09,20.7 62.38,22 R-MOTORA.1 | 59.31,33.53 68.96,33.53 | 68.96,33.53 68.99,33.53 R-OKC.1 | 69.47,32.77 69.47,33.02 68.96,33.53 | 76.33,73.53 68.96,73.53 67.56,72.14 TRIM-ADC0.E 66.67,70.36 66.67,60.71 64.64,58.67 62.1,58.67
  Bottom 0.305: 76.33,73.53 84.96,73.53 85.34,73.15 TRIM-ADC2.E | TRIM-ADC1.E 76.45,73.41 76.33,73.53
  Bottom 0.406: R-OKA.2 70.84,34.92 OK1.6 71.63,34.8 R-OKB.1 71.53,33.02 69.6,33.02 69.47,32.89 | R-OKC.1 69.47,32.89 | 69.47,32.77 69.47,32.89
VSS  (via drill 0.8)
  Top 0.305: v37.34,50.29 v37.34,36.45 | v25.4,53.59 v9.4,53.59
  Bottom 0.305: C32KA.1 61.73,53.47 | 61.73,53.47 C32KB.1 | C8MA.2 C8MB.2 55.12,38.89 S1.2 | 61.73,53.47 61.73,52.07 58.17,48.51 58.17,38.68 S1.2 | U1.28 28.98,37.95 | 28.98,37.95 28.96,37.97 27.69,37.97 | 27.69,37.97 27.56,37.85 27.56,37.72 27.48,37.64 U1.31 | U1.18 33.98,37.64 33.66,37.97 | 33.66,37.97 29.01,37.97 28.98,37.95 | 27.69,38.35 27.69,45.21 27.48,45.41 U1.47 24.05,45.41 24,45.47 24,49.28 25.4,50.67 v25.4,53.59 | 27.69,38.35 27.69,37.97 | U1.12 34.06,40.41 33.53,39.88 33.53,38.1 33.66,37.97 | 33.66,37.97 35.18,37.97 35.43,37.72 35.81,37.72 | 35.81,37.72 40.39,37.72 41.78,36.32 41.78,33.02 43.94,30.86 51.82,30.86 | S1.2 56.77,37.24 56.77,32.51 55.12,30.86 51.82,30.86 | L-PWR.C 8.64,41.02 9.02,40.64 12.7,40.64 13.08,40.26 13.08,31.24 13.84,30.48 15.37,30.48 19.18,34.29 19.18,36.32 20.32,37.47 25.91,37.47 26.8,38.35 27.69,38.35 | 18.16,73.41 15.37,73.41 14,72.04 USB.GND1 4.09,72.04 3.56,71.5 2.92,71.5 | 18.16,73.41 20.19,73.41 | 20.19,73.41 22.48,73.41 | 22.48,73.41 22.99,73.41 | IC1.26 23.25,73.15 22.99,73.41 | IC1.25 22.59,73.29 22.48,73.41 | IC1.18 18.05,73.29 18.16,73.41 | IC1.21 20,73.21 20.19,73.41 | IC1.7 20.64,63.7 20.45,63.5 10.29,63.5 | 10.29,63.5 10.14,63.5 9.4,62.76 v9.4,53.59 | ISP.3 36.32,73.15 | 36.32,73.15 36.32,73.66 35.69,74.3 23.88,74.3 22.99,73.41 | U1.63 33.98,49.6 34.8,50.42 37.21,50.42 v37.34,50.29 | v37.34,36.45 35.81,36.45 35.81,37.72 | 51.82,30.86 51.82,33.66 C-RST.1 | TRIM-ADC0.A 72.64,63.91 R-ADC0.1 | R-ADC0.1 72.92,61.49 C-ADC0.2 72.77,61.98 72.9,62.1 72.9,67.69 | TRIM-ADC1.A 81.53,67.82 | 81.53,67.69 81.53,67.56 | 81.53,64.14 81.53,63.88 C-ADC1.2 | C-ADC1.2 81.92,61.32 R-ADC1.1
  Bottom 0.305: TRIM-ADC2.A 90.42,67.69 | 90.42,67.69 90.42,64.01 C-ADC2.2 90.68,61.62 R-ADC2.1 90.68,61.57 90.68,60.07 88.52,57.91 88.52,51.82 86.61,49.91 86.61,49.78 | C-USER1.2 84.97,42.55 85.98,42.55 86.21,42.77 USER1.3 86.23,47.57 86.23,49.4 86.61,49.78 | USER2.3 95.35,44.93 | 95.35,44.93 94.74,44.32 C-USER2.2 | 95.35,44.93 95.38,44.96 | 95.38,44.96 95.38,49.02 94.61,49.78 86.61,49.78 | 89.03,34.04 89.66,34.04 95.38,39.75 95.38,44.96 | R-ADC0.1 72.92,67.67 72.9,67.69 | C-ADC1.2 81.92,63.75 81.53,64.14 | 81.53,64.14 81.53,67.56 | 81.53,67.56 81.66,67.56 | 81.66,67.56 90.3,67.56 | 90.3,67.56 90.42,67.69 | 72.9,67.69 74.8,67.69 75.18,68.07 81.28,68.07 81.53,67.82 | 81.53,67.82 81.53,67.69 | 81.53,67.69 81.66,67.56 | 90.3,67.56 90.55,67.56 90.55,73.28 88.9,74.93 67.82,74.93 65.66,72.77 36.7,72.77 36.32,73.15 | 10.29,63.5 9.53,64.26 9.53,65.53 8.13,66.93 3.03,66.93 USB.SHIELD1 USB.SHIELD3 2.92,71.5 | USB.SHIELD2 2.92,71.5
  Bottom 0.406: JPSIGIN.1 R-OKE.1 86,28.7 87.76,28.7 | C-OK.2 87.76,28.7 | OK1.5 74.04,34.42 75.18,33.27 78.36,33.27 79.12,34.04 T-OK.E 89.03,34.04 90.42,32.64 90.42,30.1 89.28,28.96 88.01,28.96 87.76,28.7 | TRIM-LCD.A 10.29,12.57 10.29,5.97 10.41,5.84 10.41,5.71 13.59,2.54 45.85,2.54 48.39,5.08
  Bottom 0.61: DIS1.16 48.39,5.08 | 48.39,5.08 45.72,2.41 13.73,2.41 DIS1.1 10.29,12.58 TRIM-LCD.A | 48.39,5.08 48.39,9.27 49.15,10.03 91.19,10.03 95.76,14.61 95.76,21.59 91.19,26.16 86.11,26.16 JPSIGIN.1

### Text on the board
tPlace: MODUL PRAKTIKUM | MICROCONTROLLER-INTERFACING | PROG / / RUN | USB | R1 / R2 / R3 | PA13 / PA12 / PA11 | PA14 / PA15 / PC10 / PC11 / PC12 / PD2 / PB3 / PB4 / PB5 / PB6 / PB7 / PB8 / PB9 / PC13 | LEDs | RESET | FREQ-OUT | SW1 / SW2 | PC9 / PC8 / PC7 / PC6 / PB15 / PB14 / PB13 / PB12 | PC0 / PC1 / PC2 / PC3 / PA0 / PA1 / PA2 | FREQ-IN | PB11 / PB10 / PB1 / PB0 / PC5 / PC4 / PA7 / PA6 / PA5 / PA4 / PA3 | CONTRAST | BUZZER | STM32F103 | OPEN-DEV v1.0 | MOTOR | MOTOR / SIGNAL